# Altium project USBDM_Kinetis_MK22F.PrjPcb
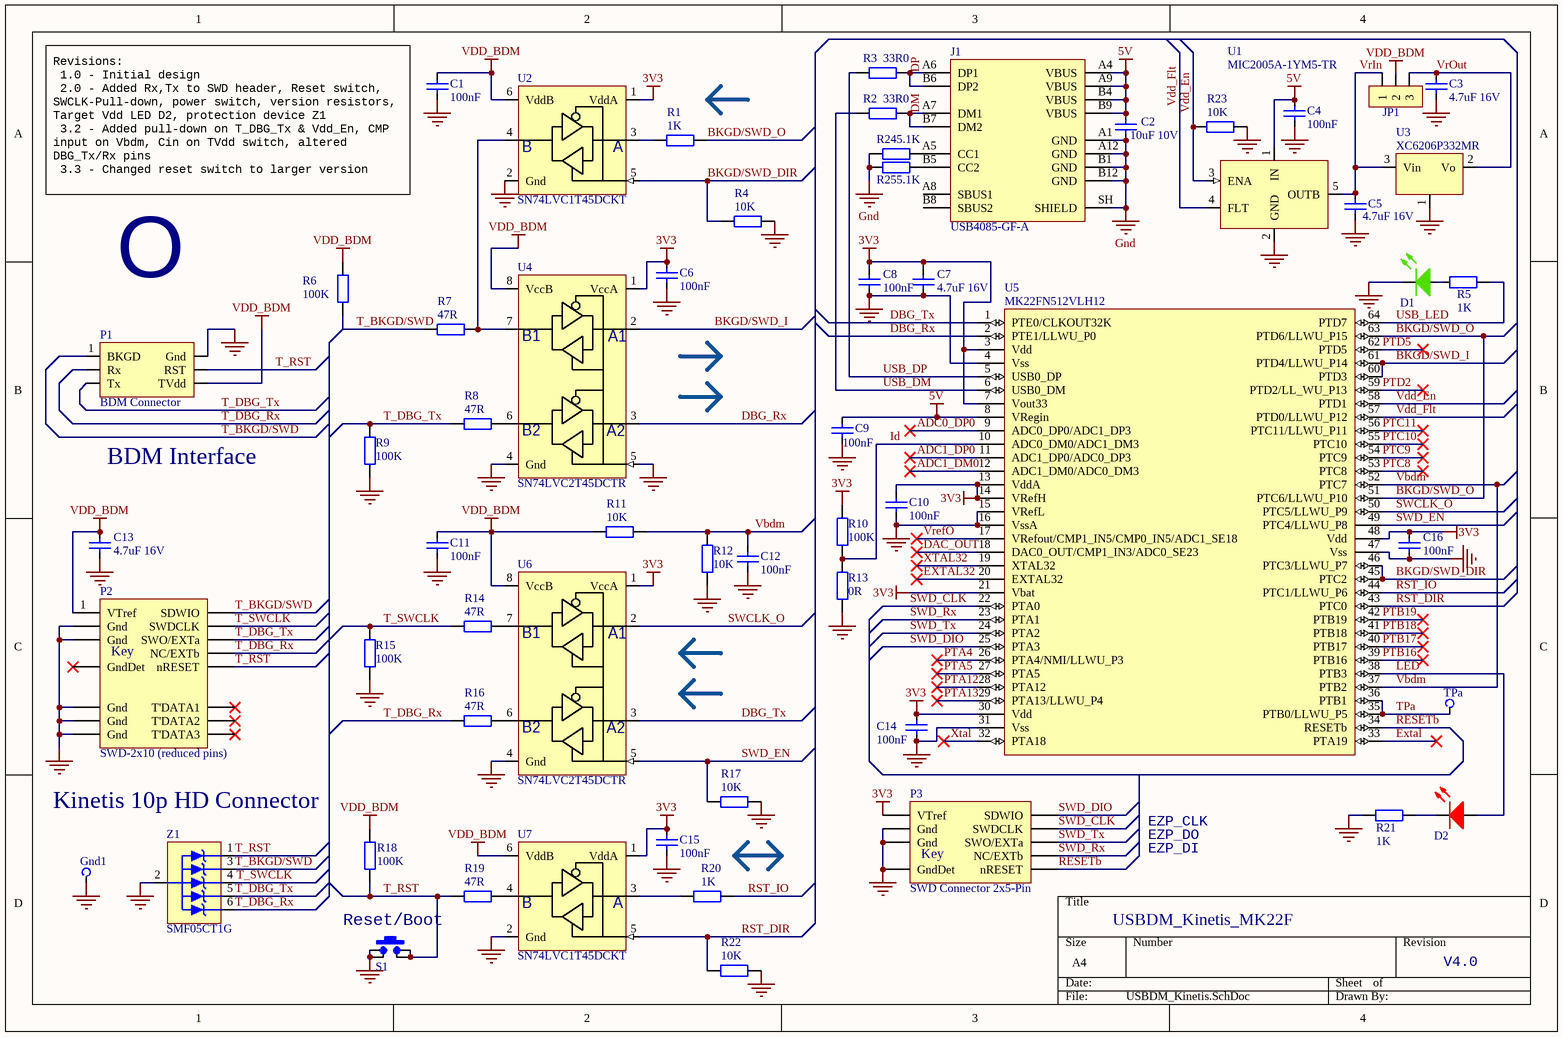
[diagram p0: USBDM_Kinetis.SchDoc]
Description: USBDM_Kinetis_MK22F; ProjectRevision: V4.0
1 sheet, 60 parts. Net scope: global (net labels, ports and power ports of the same name join across sheets).
Board file: USBDM_Kinetis.PcbDoc

## Sheet USBDM_Kinetis.SchDoc: USBDM-Kinetis
size A4

### Parts
C1  100nF  [CCNP1608-0603]
C2  10uF 10V  [CCNP1608-0603]
C3  4.7uF 16V  [CCNP1608-0603]
C4  100nF  [CCNP1608-0603]
C5  4.7uF 16V  [CCNP1608-0603]
C6  100nF  [CCNP1608-0603]
C7  4.7uF 16V  [CCNP1608-0603]
C8  100nF  [CCNP1608-0603]
C9  100nF  [CCNP1608-0603]
C10  100nF  [CCNP1608-0603]
C11  100nF  [CCNP1608-0603]
C12  100nF  [CCNP1608-0603]
C13  4.7uF 16V  [CCNP1608-0603]
C14  100nF  [CCNP1608-0603]
C15  100nF  [CCNP1608-0603]
C16  100nF  [CCNP1608-0603]
D1  LED Green  [LED1608-0603-GREEN]  (value not drawn)
D2  LED Red  [LED1608-0603-RED]  (value not drawn)
Gnd1  TP  [PCBPIN - 0.9mm]  (value not drawn)  (no BOM)
J1  USB4085-GF-A  [USB4085-GF-A]
JP1  Header 1x3 2mm  [Header 1x3 (2mm)]  (value not drawn)
Logo1  OSHW Logo  [OSHW]  (value not drawn)  (no BOM)
P1  BDM Connector  [BDM]
P2  SWD-2x10 (reduced pins)  [SWD-2x10 - reduced]
P3  SWD Connector 2x5-Pin  [SWD-2x5-Jig-Pads]  (no BOM)
R1  1K  [CR1608-0603]
R2  33R0  [CR1608-0603]
R3  33R0  [CR1608-0603]
R4  10K  [CR1608-0603]
R5  1K  [CR1608-0603]
R6  100K  [CR1608-0603]
R7  47R  [CR1608-0603]
R8  47R  [CR1608-0603]
R9  100K  [CR1608-0603]
R10  100K  [CR1608-0603]
R11  10K  [CR1608-0603]
R12  10K  [CR1608-0603]
R13  0R  [CR1608-0603]
R14  47R  [CR1608-0603]
R15  100K  [CR1608-0603]
R16  47R  [CR1608-0603]
R17  10K  [CR1608-0603]
R18  100K  [CR1608-0603]
R19  47R  [CR1608-0603]
R20  1K  [CR1608-0603]
R21  1K  [CR1608-0603]
R22  10K  [CR1608-0603]
R23  10K  [CR1608-0603]
R24  5.1K  [CR1608-0603]
R25  5.1K  [CR1608-0603]
S1  SMD-SW-4_5.1x5.1x2.0_M  [SMD-SW-4_5.1x5.1x2.0_M]  (value not drawn)
TPa  TP  [PCBPIN - 0.9mm]  (value not drawn)  (no BOM)
U1  MIC2005A-1YM5-TR  [SOT23-5-Power]
U2  SN74LVC1T45DCKT  [SC70_N]
U3  XC6206P332MR  [SOT23_N]
U4  SN74LVC2T45DCTR  [SSOP8_N]
U5  MK22FN512VLH12  [TSQFP50P1200X1200-64N]
U6  SN74LVC2T45DCTR  [SSOP8_N]
U7  SN74LVC1T45DCKT  [SC70_N]
Z1  SMF05CT1G  [SC70_N]

### Nets
3V3: C6.1 C7.2 C8.2 C10.2 C14.2 C15.1 C16.1 P3.1(VTref) R10.1 U2.1(VddA) U4.1(VccA) U5.3(Vdd) U5.7(Vout33) U5.13(VddA) U5.14(VRefH) U5.21(Vbat) U5.30(Vdd) U5.48(Vdd) U6.1(VccA) U7.1(VddA)
5V: C2.2 C4.2 C9.2 J1.A4(VBUS) J1.A9(VBUS) J1.B4(VBUS) J1.B9(VBUS) U1.1(IN) U5.8(VRegin)
GND: C1.1 C2.1 C3.2 C4.1 C5.2 C6.2 C7.1 C8.1 C9.1 C10.1 C11.1 C12.2 C13.1 C14.1 C15.2 C16.2 D1.K Gnd1.1(TP) J1.A1(GND) J1.A12(GND) J1.B1(GND) J1.B12(GND) J1.SH(SHIELD) P1.2(Gnd) P2.3(Gnd) P2.5(Gnd) P2.15(Gnd) P2.17(Gnd) P2.19(Gnd) P3.3(Gnd) P3.5(Gnd) P3.9(GndDet) R4.2 R9.1 R12.2 R13.1 R15.1 R17.2 R21.1 R22.2 R23.1 R24.2 R25.2 S1.1 S1.1b U1.2(GND) U2.2(Gnd) U3.1(Gnd) U4.4(Gnd) U4.5(DIR) U5.4(Vss) U5.15(VRefL) U5.16(VssA) U5.31(Vss) U5.47(Vss) U6.4(Gnd) U7.2(Gnd) Z1.2
VDD_BDM: C1.2 C11.2 C13.2 JP1.2 P1.6(TVdd) P2.1(VTref) R6.1 R11.2 R18.1 U2.6(VddB) U4.8(VccB) U6.8(VccB) U7.6(VddB)
ADC0_DP0: U5.9(ADC0_DP0/ADC1_DP3)
ADC1_DM0: U5.12(ADC1_DM0/ADC0_DM3)
ADC1_DP0: U5.11(ADC1_DP0/ADC0_DP3)
BKGD/SWD_DIR: R4.1 U2.5(DIR) U5.45(PTC2) U5.46(PTC3/LLWU_P7)
BKGD/SWD_I: U4.2(A1) U5.60(PTD3) U5.61(PTD4/LLWU_P14)
BKGD/SWD_O: R1.1 U5.51(PTC6/LLWU_P10) U5.63(PTD6/LLWU_P15)
DAC_OUT: U5.18(DAC0_OUT/CMP1_IN3/ADC0_SE23)
DBG_Rx: U4.3(A2) U5.2(PTE1/LLWU_P0)
DBG_Tx: U5.1(PTE0/CLKOUT32K) U6.3(A2)
DM: J1.A7(DM1) J1.B7(DM2) R2.1
DP: J1.A6(DP1) J1.B6(DP2) R3.1
Extal: U5.33(PTA19)
EXTAL32: U5.20(EXTAL32)
Id: R10.2 R13.2 U5.10(ADC0_DM0/ADC1_DM3)
LED: D2.A U5.38(PTB3)
PTA4: U5.26(PTA4/NMI/LLWU_P3)
PTA5: U5.27(PTA5)
PTA12: U5.28(PTA12)
PTA13: U5.29(PTA13/LLWU_P4)
PTB16: U5.39(PTB16)
PTB17: U5.40(PTB17)
PTB18: U5.41(PTB18)
PTB19: U5.42(PTB19)
PTC8: U5.53(PTC8)
PTC9: U5.54(PTC9)
PTC10: U5.55(PTC10)
PTC11: U5.56(PTC11/LLWU_P11)
PTD2: U5.59(PTD2/LL_WU_P13)
PTD5: U5.62(PTD5)
RESETb: P3.10(nRESET) U5.34(RESETb)
RST_DIR: R22.1 U5.43(PTC0) U7.5(DIR)
RST_IO: R20.1 U5.44(PTC1/LLWU_P6)
SWCLK_O: U5.50(PTC5/LLWU_P9) U6.2(A1)
SWD_CLK: P3.4(SWDCLK) U5.22(PTA0)
SWD_DIO: P3.2(SDWIO) U5.25(PTA3)
SWD_EN: R17.1 U5.49(PTC4/LLWU_P8) U6.5(DIR)
SWD_Rx: P3.8(NC/EXTb) U5.23(PTA1)
SWD_Tx: P3.6(SWO/EXTa) U5.24(PTA2)
T_BKGD/SWD: P1.1(BKGD) P2.2(SDWIO) R6.2 R7.2 Z1.3
T_DBG_Rx: P1.3(Rx) P2.8(NC/EXTb) R16.2 Z1.6
T_DBG_Tx: P1.5(Tx) P2.6(SWO/EXTa) R8.2 R9.2 Z1.5
T_RST: P1.4(RST) P2.10(nRESET) R18.2 R19.2 S1.2 S1.2b Z1.1
T_SWCLK: P2.4(SWDCLK) R14.2 R15.2 Z1.4
TPa: TPa.1(TP) U5.35(PTB0/LLWU_P5) U5.36(PTB1)
USB_DM: R2.2 U5.6(USB0_DM)
USB_DP: R3.2 U5.5(USB0_DP)
USB_LED: R5.1 U5.64(PTD7)
Vbdm: C12.1 R11.1 R12.1 U5.37(PTB2) U5.52(PTC7)
Vdd_En: R23.2 U1.3(ENA) U5.58(PTD1)
Vdd_Flt: U1.4(FLT) U5.57(PTD0/LLWU_P12)
VrefO: U5.17(VRefout/CMP1_IN5/CMP0_IN5/ADC1_SE18)
VrIn: C5.1 JP1.1 U1.5(OUTB) U3.3(Vin)
VrOut: C3.1 JP1.3 U3.2(Vo)
Xtal: U5.32(PTA18)
XTAL32: U5.19(XTAL32)
NetD1_A: D1.A R5.2
NetD2_K: D2.K R21.2
NetJ1_A5: J1.A5(CC1) R24.1
NetJ1_B5: J1.B5(CC2) R25.1
NetR1_2: R1.2 U2.3(A)
NetR7_1: R7.1 U2.4(B) U4.7(B1)
NetR8_1: R8.1 U4.6(B2)
NetR14_1: R14.1 U6.7(B1)
NetR16_1: R16.1 U6.6(B2)
NetR19_1: R19.1 U7.4(B)
NetR20_2: R20.2 U7.3(A)

Not connected (* = marked no-connect by the designer): J1 A8(SBUS1) B8(SBUS2); P2 9(GndDet)* 16(T'DATA1)* 18(T'DATA2)* 20(T'DATA3)*

### Notes on the sheet
- (near C1) Revisions:
  1.0 - Initial design
  2.0 - Added Rx,Tx to SWD header, Reset switch,
  SWCLK-Pull-down, power switch, version resistors,
  Target Vdd LED D2, protection device Z1
  3.2 - Added pull-down on T_DBG_Tx & Vdd_En, CMP input on Vbdm, Cin on TVdd switch, altered DBG_Tx/Rx pins
  3.3 - Changed reset switch to larger version
- BDM Interface
- Kinetis 10p HD Connector
- EZP_CLK
- EZP_DI
- EZP_DO
- (near S1) Reset/Boot
- (in symbol OSHW Logo) O
- (in symbol SWD2X5_JIG) Key
- (in symbol SWD2X10-Reduced) Key
- (in symbol SWD2X5) Key

### Library data of the parts
C1 C4 C6 C8-C12 C14-C16 = Cap_CCNP_0603_100nF: Capacitor non-polar SMT 0603; Manufacturer: Generic Components; Class: Passive; Published: 08/06/2000; Publisher: Altium Hobart Technology Centre; SubClass: Capacitor; Farnell PN: *; Digikey: *; Value: 100nF; LCSC: C14663
C2 = Cap_CCNP_0603: Capacitor non-polar SMT 0603; Manufacturer: Generic Components; Class: Passive; Published: 08/06/2000; Publisher: Altium Hobart Technology Centre; SubClass: Capacitor; Farnell PN: *; Digikey: *; Value: 10uF 10V; LCSC: C19702
C3 C5 C7 C13 = Cap_CCNP_0603: Capacitor SMT 0603; Manufacturer: Generic Components; Class: Passive; Published: 08/06/2000; Publisher: Altium Hobart Technology Centre; SubClass: Capacitor; Digikey: *; Value: 4.7uF 16V; LCSC: C19666
D1 = LED-0603-Green: LED 0603 Green; Manufacturer: Generic Components; Class I: Optoelectronic; Published: 8-Jun-2000; Revision: July-2002: Re-released for DXP Platform.; Publisher: Altium Limited; Class II: LED; Farnell PN: 1581242; Digikey: *; LCSC: C72043
D2 = LED-0603-Red: LED 0603 Red; Manufacturer: Generic Components; Class I: Optoelectronic; Published: 8-Jun-2000; Revision: July-2002: Re-released for DXP Platform.; Publisher: Altium Limited; Class II: LED; Farnell PN: 1581239; Digikey: *; LCSC: C2286
Gnd1 TPa = TP: Test Point; Digikey: *; Farnell PN: *
J1 = USB4085-GF-A: USB-C, USB 2.0 Receptacle Connector 16 Position Through Hole, Right Angle; Angle: 90; Part Number: USB4085-GF-A; Digikey Part Number: 2073-USB4085-GF-ACT-ND; Digikey Link: https://www.digikey.ee/product-detail/en/gct/USB4085-GF-A/2073-USB4085-GF-ACT-ND/9859733; Digikey: 2073-USB4085-GF-ACT-ND; Farnell PN: 2924867; LCSC: *
JP1 = Header 1x3 2mm: Header, 1x3, 2mm; Manufacturer: Generic Components; Class I: Connector; Revision: July-2002: Re-released for DXP Platform.; Publisher: Altium Limited; Digikey: *; Farnell PN: *
P1 = BDM2X3: HCS BDM connector (2x3 0.1")
P2 = SWD2X10-Reduced: SWD Connector 2x10-Pin (reduced pins); LatestRevisionDate: 17-Jul-2002; LatestRevisionNote: Re-released for DXP Platform.; Publisher: Altium Limited; Farnell PN: 1865289
P3 = SWD2X5_JIG: LatestRevisionDate: 17-Jul-2002; LatestRevisionNote: Re-released for DXP Platform.; Publisher: Altium Limited; Farnell PN: 1865285; LCSC: *
R1-R9 R11 R12 R14-R23 = Res: Resistor SMT 0603; Manufacturer: Generic Components; Class: Passive; Published: 08/06/2000; Publisher: Altium Hobart Technology Centre; SubClass: Resistor
  R1 R20: Value: 1K; Farnell PN: 2331727; Digikey: *; LCSC: C21190
  R2 R3: Farnell PN: 1632431; Digikey: *; Value: 33R0; LCSC: C23140
  R4 R11 R12 R17 R22: Value: 10K; Farnell PN: 1799366; Digikey: *; LCSC: C25804
  R5 R21: Value: 1K; Farnell PN: 2502447; Digikey: *; LCSC: C21190
  R6: Value: 100K; Farnell PN: 9238727; Digikey: *; LCSC: C25803
  R7 R8 R14 R16 R19: Value: 47R; Farnell PN: 1646283; Digikey: *; LCSC: C23182
  R9 R15 R18: Value: 100K; Farnell PN: 9238727; LCSC: C25803
  R23: Farnell PN: 1799366; Digikey: *; Value: 10K; LCSC: C25804
R10 R13 R24 R25 = Res_CR0603: Resistor SMT 0603; Manufacturer: Generic Components; Class: Passive; Published: 08/06/2000; Publisher: Altium Hobart Technology Centre; SubClass: Resistor; Digikey: *
  R10: Farnell PN: 9238727; Value: 100K; LCSC: C25803
  R13: Farnell PN: 2668260; Value: 0R; LCSC: C21189
  R24 R25: Farnell PN: *; Value: 5.1K; LCSC: C23186
S1 = SW_PB-TS: Tactile Switch SPST 5.10mm X 5.10mm / (1.5mm=C318884) / (2.0mm=C318888) / (3.5mm=C318886); Revision: 1.0; LCSC: C318888
U1 = MIC2005A-1YM5-TR: Power Switch 0.5A, active-high enable; Farnell PN: *; Digikey: *; LCSC: C81399
U2 U7 = SN74LVC1T45DCKT: Dual voltage bidirection buffer; Digikey: *; Farnell PN: 9592733; LCSC: C80768
U3 = XC6206P332MR: 3V3 200mA, LDO regulator (Low ESR ceramic caps); Farnell PN: 8796980; LCSC: C5446
U4 U6 = SN74LVC2T45DCTR: Dual voltage bidirection buffer; Digikey: *; Farnell PN: 2008640; LCSC: C22672
U5 = MK22FN1M0VLH12: Arm Cortex M4F; Farnell PN: 2434224
Z1 = SMF05CT1G: TVS DIODE ARRAY, 100W, 5V, SC-70; Digikey: SMF05CT1GOSCT-ND; Farnell PN: 2533147; LCSC: C15879